# EAGLE design VIA_PAR_Adapter_1541C (EAGLE 9.6.2)
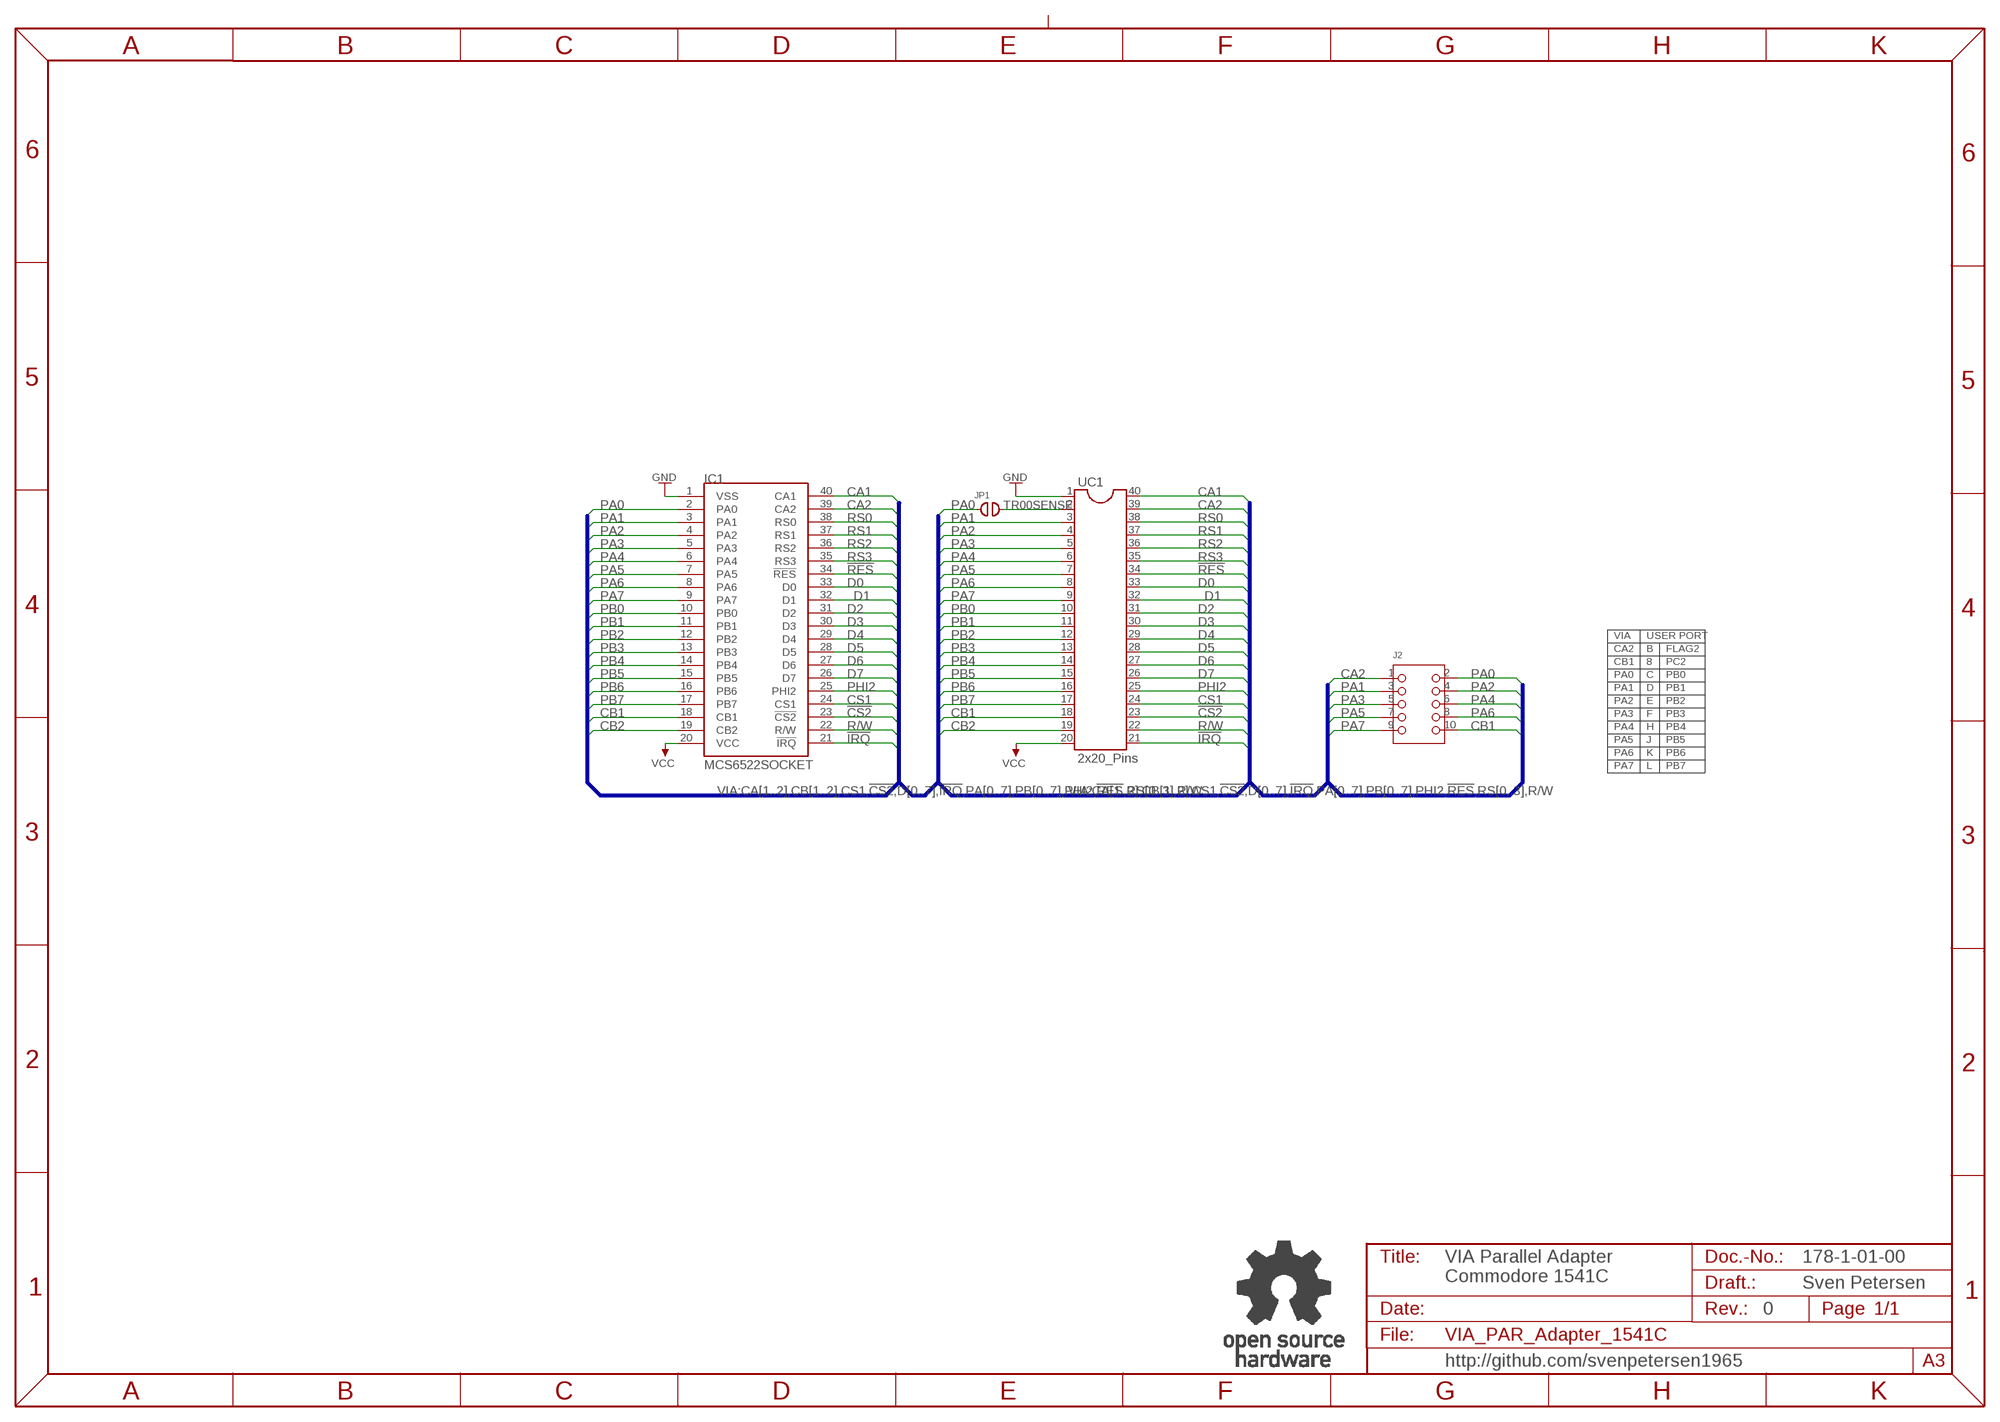
[diagram p0: schematic, sheet 1]

## Parts
IC1  MCS6522SOCKET  [GS40P]
J2  2X05WV  [2X05WV]
JP1  COMBI_2P  [COMBI-2P]
U$10  OPEN_SOURCE_HW  [OPENHW]
UC1  2x20_Pins  IC_DIL40  [DIL40_PINS_SS]

## Nets
!CS2: IC1.23(!CS2) UC1.23
!IRQ: IC1.21(!IRQ) UC1.21
!RES: IC1.34(!RES) UC1.34
CA1: IC1.40(CA1) UC1.40
CA2: IC1.39(CA2) J2.1 UC1.39
CB1: IC1.18(CB1) J2.10 UC1.18
CB2: IC1.19(CB2) UC1.19
CS1: IC1.24(CS1) UC1.24
D0: IC1.33(D0) UC1.33
D1: IC1.32(D1) UC1.32
D2: IC1.31(D2) UC1.31
D3: IC1.30(D3) UC1.30
D4: IC1.29(D4) UC1.29
D5: IC1.28(D5) UC1.28
D6: IC1.27(D6) UC1.27
D7: IC1.26(D7) UC1.26
GND: IC1.1(VSS) UC1.1
PA0: IC1.2(PA0) J2.2 JP1.1
PA1: IC1.3(PA1) J2.3 UC1.3
PA2: IC1.4(PA2) J2.4 UC1.4
PA3: IC1.5(PA3) J2.5 UC1.5
PA4: IC1.6(PA4) J2.6 UC1.6
PA5: IC1.7(PA5) J2.7 UC1.7
PA6: IC1.8(PA6) J2.8 UC1.8
PA7: IC1.9(PA7) J2.9 UC1.9
PB0: IC1.10(PB0) UC1.10
PB1: IC1.11(PB1) UC1.11
PB2: IC1.12(PB2) UC1.12
PB3: IC1.13(PB3) UC1.13
PB4: IC1.14(PB4) UC1.14
PB5: IC1.15(PB5) UC1.15
PB6: IC1.16(PB6) UC1.16
PB7: IC1.17(PB7) UC1.17
PHI2: IC1.25(PHI2) UC1.25
R/W: IC1.22(R/W) UC1.22
RS0: IC1.38(RS0) UC1.38
RS1: IC1.37(RS1) UC1.37
RS2: IC1.36(RS2) UC1.36
RS3: IC1.35(RS3) UC1.35
TR00SENSE: JP1.2 UC1.2
VCC: IC1.20(VCC) UC1.20

## Buses
VIA:CA[1..2],CB[1..2],CS1,!CS2,D[0..7],!IRQ,PA[0..7],PB[0..7],PHI2,!RES,RS[0..3],R/W

## Notes on the sheet
- VIA | USER PORT
- CA2 | B | !FLAG2
- CB1 | 8 | !PC2
- PA0 | C | PB0
- PA1 | D | PB1
- PA2 | E | PB2
- PA3 | F | PB3
- PA4 | H | PB4
- PA5 | J | PB5
- PA6 | K | PB6
- PA7 | L | PB7
- 178-1-01-00
- VIA Parallel Adapter
  Commodore 1541C
- Sven Petersen
- 0
- http://github.com/svenpetersen1965

## Library data of the parts
IC1 = MOS:MCS6522
J2 = PINHEAD:2X05WV
JP1 = Cutpad:COMBI_2P
U$10 = Logo:OPEN_SOURCE_HW
UC1 = MOS:IC_DIL40

## Board
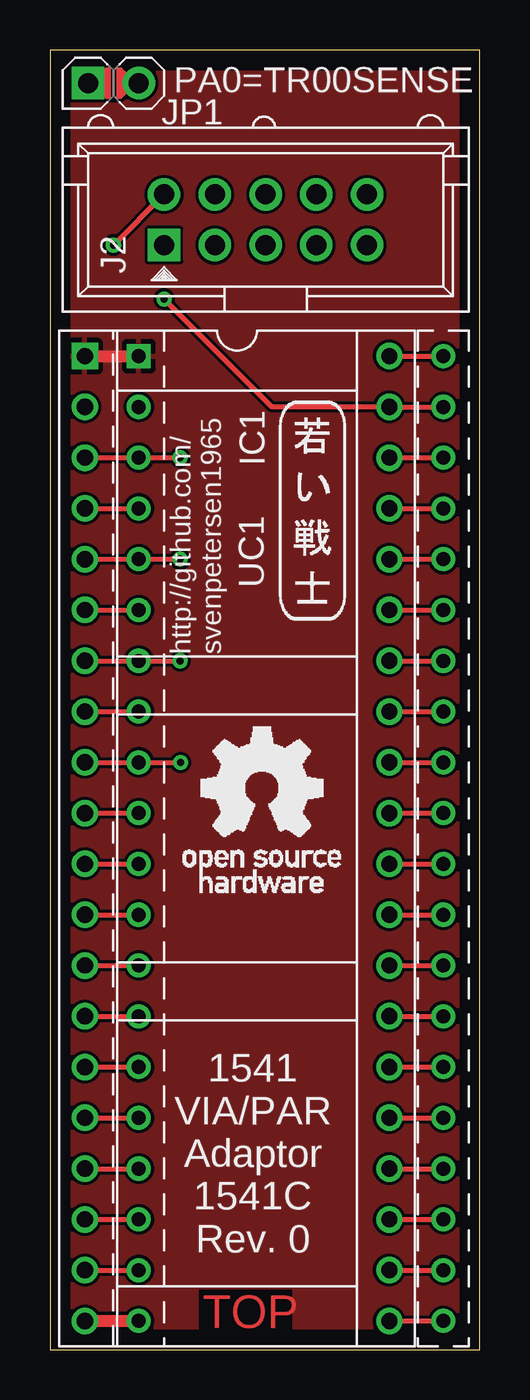
[diagram p1: board, top side]
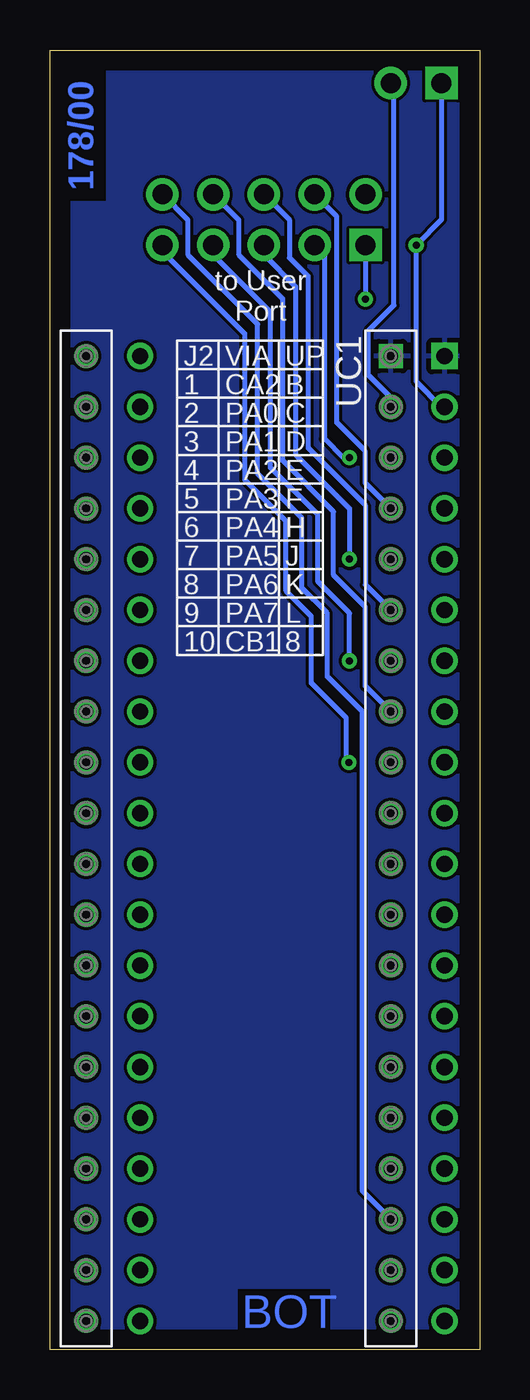
[diagram p2: board, bottom side, seen from below]

Size 21.5 x 65 mm. Coordinates in mm from the lower left corner, seen from the top.
Outline: 0,0 21.5,0 21.5,65 0,65 0,0
Copper layers (1*16): Top 0.035mm / dielectric 1.5mm / Bottom 0.035mm
Design rules "default *": minimum track width 6mil, minimum drill 0.35mm, track to track 6mil, track to pad 6mil, pad to pad 6mil, via to via 6mil, smd to smd 6mil, copper to edge 40mil, drill to drill 6mil, minimum pad ring 10mil, minimum via ring 8mil, stop-mask expansion 4mil, vias tented up to drill 25mil, thermal gap 10mil
bRestrict: 2 lines

### Footprints (pad centres in the part's own frame; a part is rotated, then mirrored left to right if it is on the bottom)
GS40P = drill 0.813 square: 1 -24.13,-7.62 | drill 0.813: 2 -21.59,-7.62; 3 -19.05,-7.62; 4 -16.51,-7.62; 5 -13.97,-7.62; 6 -11.43,-7.62; 7 -8.89,-7.62; 8 -6.35,-7.62; 9 -3.81,-7.62; 10 -1.27,-7.62; 11 1.27,-7.62; 12 3.81,-7.62; 13 6.35,-7.62; 14 8.89,-7.62; 15 11.43,-7.62; 16 13.97,-7.62; 17 16.51,-7.62; 18 19.05,-7.62; 19 21.59,-7.62; 20 24.13,-7.62; 21 24.13,7.62; 22 21.59,7.62; 23 19.05,7.62; 24 16.51,7.62; 25 13.97,7.62; 26 11.43,7.62; 27 8.89,7.62; 28 6.35,7.62; 29 3.81,7.62; 30 1.27,7.62; 31 -1.27,7.62; 32 -3.81,7.62; 33 -6.35,7.62; 34 -8.89,7.62; 35 -11.43,7.62; 36 -13.97,7.62; 37 -16.51,7.62; 38 -19.05,7.62; 39 -21.59,7.62; 40 -24.13,7.62
2X05WV = drill 1 pad 1.626 square: 1 -5.08,-1.27 | drill 1 pad 1.626: 2 -5.08,1.27; 3 -2.54,-1.27; 4 -2.54,1.27; 5 0,-1.27; 6 0,1.27; 7 2.54,-1.27; 8 2.54,1.27; 9 5.08,-1.27; 10 5.08,1.27
COMBI-2P = drill 1 pad 1.626 square: 1 -1.27,0 | drill 1 pad 1.626: 2 1.27,0
DIL40_PINS_SS = drill 0.7 square: 1 -24.13,-7.62 | drill 0.7: 2 -21.59,-7.62; 3 -19.05,-7.62; 4 -16.51,-7.62; 5 -13.97,-7.62; 6 -11.43,-7.62; 7 -8.89,-7.62; 8 -6.35,-7.62; 9 -3.81,-7.62; 10 -1.27,-7.62; 11 1.27,-7.62; 12 3.81,-7.62; 13 6.35,-7.62; 14 8.89,-7.62; 15 11.43,-7.62; 16 13.97,-7.62; 17 16.51,-7.62; 18 19.05,-7.62; 19 21.59,-7.62; 20 24.13,-7.62; 21 24.13,7.62; 22 21.59,7.62; 23 19.05,7.62; 24 16.51,7.62; 25 13.97,7.62; 26 11.43,7.62; 27 8.89,7.62; 28 6.35,7.62; 29 3.81,7.62; 30 1.27,7.62; 31 -1.27,7.62; 32 -3.81,7.62; 33 -6.35,7.62; 34 -8.89,7.62; 35 -11.43,7.62; 36 -13.97,7.62; 37 -16.51,7.62; 38 -19.05,7.62; 39 -21.59,7.62; 40 -24.13,7.62

### Placement (x,y rotation side)
IC1  9.37,25.56 270 top
J2  10.79,56.51 0 top
JP1  3.17,63.34 0 top
U$6  [2LAYER]  7.64,1.08 0 top
U$7  [PCB-TITLE/]  0,73.72 0 top  (outside the outline)
U$8  [SVEN_TAG]  13.18,42.07 0 top
U$10  6.67,22.86 0 top
UC1  12.06,25.56 270 top

### Tracks (layer width: path | path; a pad name or v marks a point on that pad's centre or on a via)
!CS2
  Top 0.254: IC1.23 UC1.23
!IRQ
  Top 0.254: IC1.21 UC1.21
!RES
  Top 0.254: IC1.34 UC1.34
CA1
  Top 0.254: IC1.40 UC1.40
CA2  (via drill 0.35)
  Top 0.254: UC1.39 IC1.39 11.11,47.15 v5.71,52.55
  Bottom 0.254: J2.1 v5.71,52.55
CB1
  Top 0.254: IC1.18 UC1.18
  Bottom 0.254: UC1.18 5.87,7.94 5.87,31.91 7.62,33.66 7.62,36.83 8.89,38.1 8.89,41.59 11.11,43.81 11.11,51.28 14.6,54.77 14.6,56.51 J2.10
CB2
  Top 0.254: IC1.19 UC1.19
CS1
  Top 0.254: IC1.24 UC1.24
D0
  Top 0.254: IC1.33 UC1.33
D1
  Top 0.254: IC1.32 UC1.32
D2
  Top 0.254: IC1.31 UC1.31
D3
  Top 0.254: IC1.30 UC1.30
D4
  Top 0.254: IC1.29 UC1.29
D5
  Top 0.254: IC1.28 UC1.28
D6
  Top 0.254: IC1.27 UC1.27
D7
  Top 0.254: IC1.26 UC1.26
GND
  Top 0.61: IC1.1 UC1.1
  pour Bottom: 0.48,64.44 20.95,64.44 20.95,0.79 0.48,0.79
  pour Top: 0.48,0.79 0.48,64.45 20.95,64.45 20.95,0.79
PA0  (via drill 0.35)
  Top 0.254: v3.17,55.24 J2.2
  Bottom 0.254: IC1.2 1.91,47.15 3.17,48.42 v3.17,55.24 1.91,56.52 JP1.1
PA1  (via drill 0.35)
  Top 0.254: IC1.3 UC1.3 v6.51,44.61
  Bottom 0.254: v6.51,44.61 6.83,44.61 7.78,45.56 7.78,54.76 J2.3
PA2
  Top 0.254: IC1.4 UC1.4
  Bottom 0.254: UC1.4 5.71,43.34 5.71,44.93 7.14,46.35 7.14,56.67 J2.4
PA3  (via drill 0.35)
  Top 0.254: IC1.5 UC1.5 v6.51,39.53
  Bottom 0.254: v6.51,39.53 6.51,42.07 9.2,44.76 9.2,53.17 10.79,54.76 J2.5
PA4
  Top 0.254: IC1.6 UC1.6
  Bottom 0.254: UC1.6 5.71,38.26 5.71,42.23 8.57,45.09 8.57,53.66 9.52,54.61 9.52,56.51 J2.6
PA5  (via drill 0.35)
  Top 0.254: IC1.7 UC1.7 v6.51,34.45
  Bottom 0.254: v6.51,34.45 6.51,36.83 8.1,38.42 8.1,41.75 10.48,44.13 10.48,51.91 13.33,54.76 J2.7
PA6
  Top 0.254: IC1.8 UC1.8
  Bottom 0.254: UC1.8 5.71,33.18 5.71,37.15 7.3,38.73 7.3,41.91 9.84,44.45 9.84,52.55 12.06,54.77 12.06,56.51 J2.8
PA7  (via drill 0.35)
  Top 0.254: IC1.9 UC1.9 6.51,29.37 v6.53,29.37
  Bottom 0.254: v6.53,29.37 6.67,29.5 6.67,31.59 8.41,33.34 8.41,36.67 9.68,37.94 9.68,41.43 11.75,43.5 11.75,50.8 15.87,54.92 J2.9
PB0
  Top 0.254: IC1.10 UC1.10
PB1
  Top 0.254: IC1.11 UC1.11
PB2
  Top 0.254: IC1.12 UC1.12
PB3
  Top 0.254: IC1.13 UC1.13
PB4
  Top 0.254: IC1.14 UC1.14
PB5
  Top 0.254: IC1.15 UC1.15
PB6
  Top 0.254: IC1.16 UC1.16
PB7
  Top 0.254: IC1.17 UC1.17
PHI2
  Top 0.254: IC1.25 UC1.25
R/W
  Top 0.254: IC1.22 UC1.22
RS0
  Top 0.254: IC1.38 UC1.38
RS1
  Top 0.254: IC1.37 UC1.37
RS2
  Top 0.254: IC1.36 UC1.36
RS3
  Top 0.254: IC1.35 UC1.35
TR00SENSE
  Bottom 0.254: UC1.2 4.45,47.62 5.56,48.74 5.56,50.96 4.29,52.23 4.29,63.18 JP1.2
VCC
  Top 0.61: IC1.20 UC1.20

### Text on the board
Bottom: 178/00
tPlace: PA0=TR00SENSE | UC1 | http://github.com/ / svenpetersen1965 | 1541 / VIA/PAR / Adaptor / 1541C / Rev. 0
bPlace: to User / Port | UP | VIA | J2 | B | CA2 | 1 | C | PA0 | 2 | D | PA1 | 3 | E | PA2 | 4 | F | PA3 | 5 | H | PA4 | 6 | J | PA5 | 7 | K | PA6 | 8 | L | PA7 | 9 | 8 | CB1 | 10
Document: 178-2-01-00 | Sven Petersen / 2021 | 35µm | 2 | 0